# EAGLE design SparkFun_Ublox SAM-M8Q (EAGLE 9.2.1)
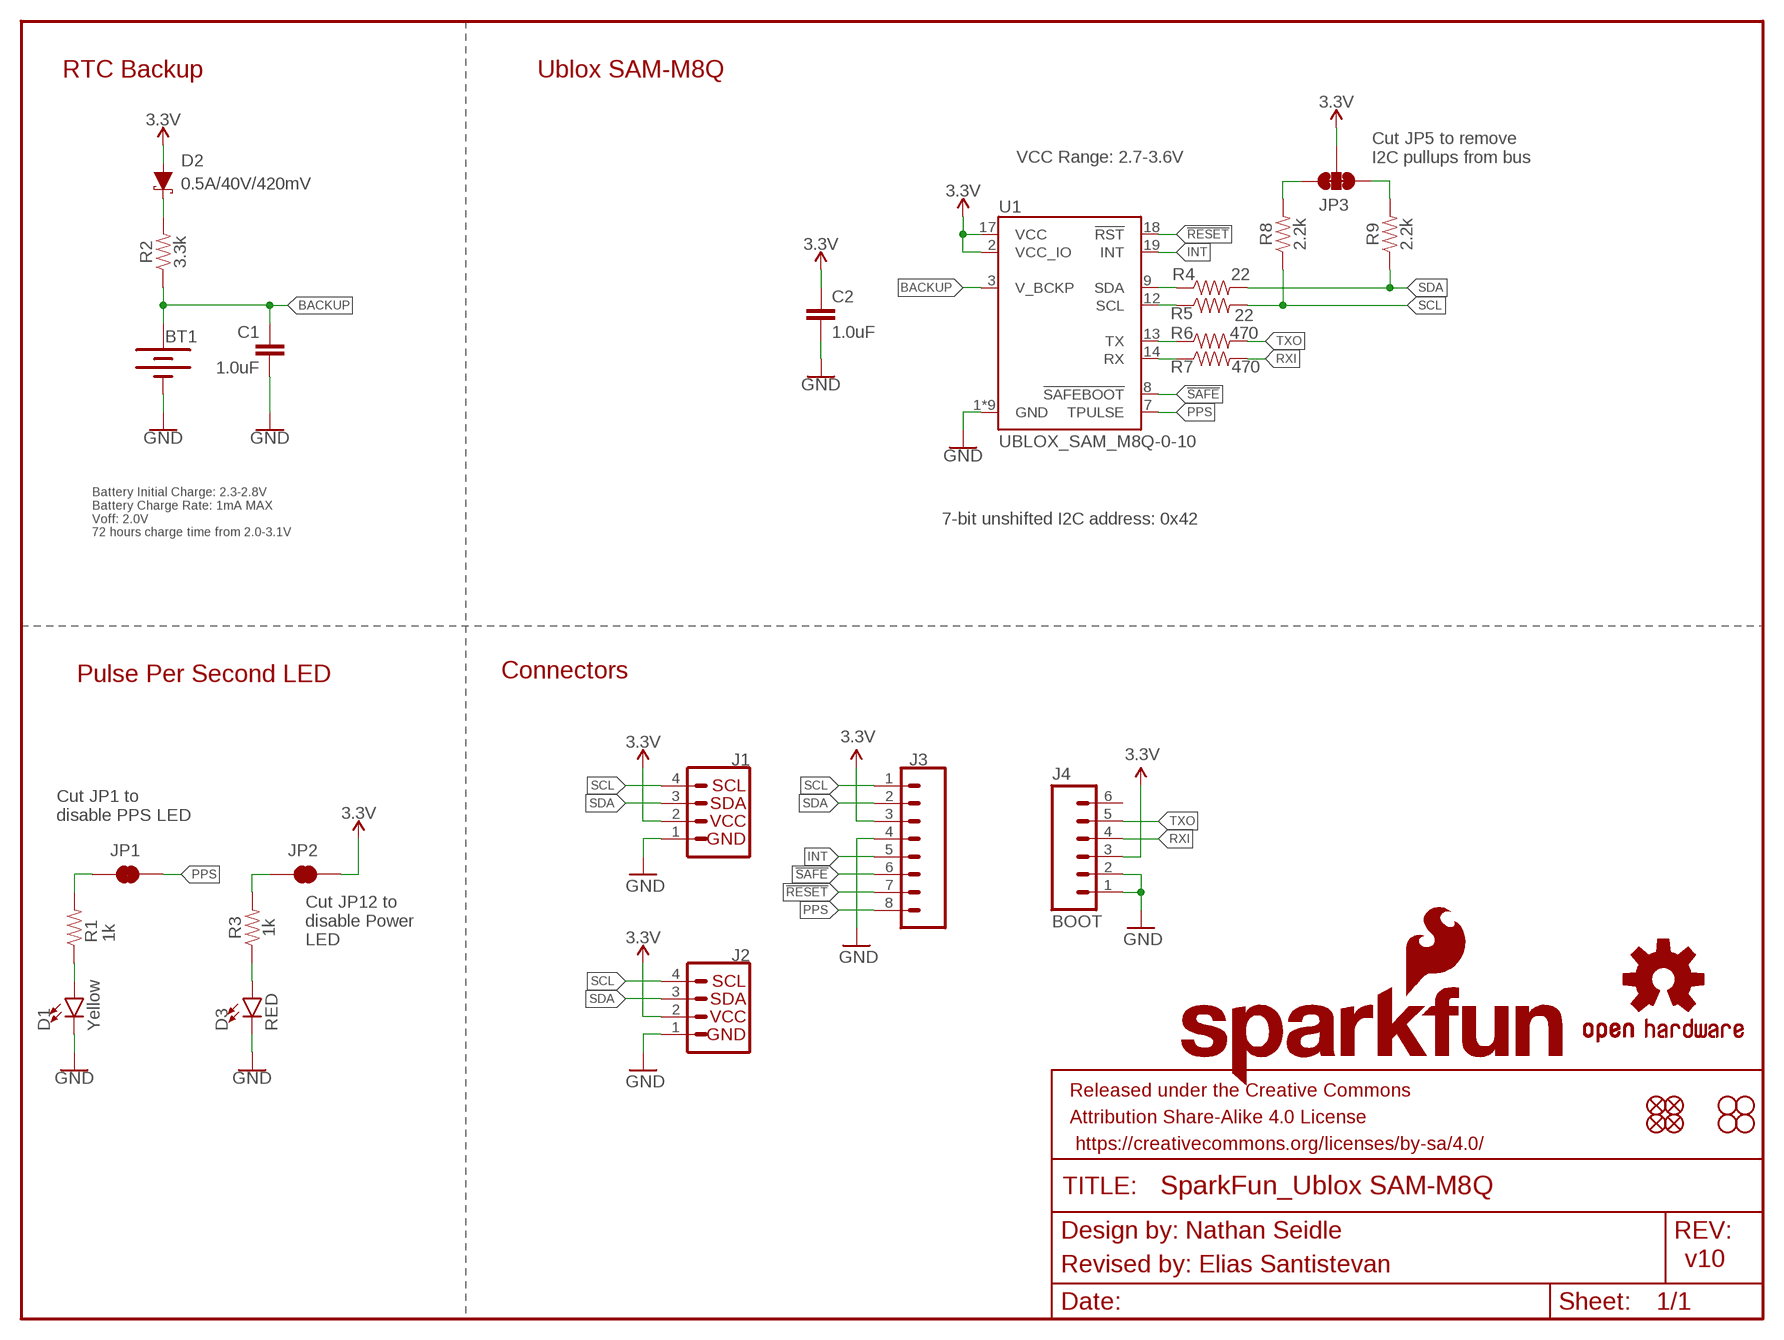
[diagram p0: schematic, sheet 1]

## Parts
BT1  6.8MM_COIN_CELL  ML414H_IV01E_BATTERY  [ML414H_IV01E]
C1  1.0uF  1.0UF-0603-16V-10%  [0603]
C2  1.0uF  1.0UF-0603-16V-10%  [0603]
D1  Yellow  LED-YELLOW0603  [LED-0603]
D2  0.5A/40V/420mV  DIODE-SCHOTTKY-PMEG4005EJ  [SOD-323]
D3  RED  LED-RED0603  [LED-0603]
FD1  FIDUCIALUFIDUCIAL  [FIDUCIAL-MICRO]
FD2  FIDUCIALUFIDUCIAL  [FIDUCIAL-MICRO]
FD3  FIDUCIALUFIDUCIAL  [FIDUCIAL-MICRO]
FD4  FIDUCIALUFIDUCIAL  [FIDUCIAL-MICRO]
FRAME1  FRAME-LETTER  [CREATIVE_COMMONS]
H1  STAND-OFF  [STAND-OFF]
H2  STAND-OFF  [STAND-OFF]
H3  STAND-OFF  [STAND-OFF]
H4  STAND-OFF  [STAND-OFF]
J1  Qwiic Right Angle  I2C_STANDARDQWIIC  [JST04_1MM_RA]
J2  Qwiic Right Angle  I2C_STANDARDQWIIC  [JST04_1MM_RA]
J3  CONN_08NO_SILK_FEMALE_PTH  [1X08_NO_SILK]
J4  BOOT  CONN_06NO_SILK_NO_POP  [1X06_NO_SILK]
JP1  JUMPER-SMT_2_NC_TRACE_SILK  [SMT-JUMPER_2_NC_TRACE_SILK]
JP2  JUMPER-SMT_2_NC_TRACE_SILK  [SMT-JUMPER_2_NC_TRACE_SILK]
JP3  JUMPER-SMT_3_2-NC_TRACE_SILK  [SMT-JUMPER_3_2-NC_TRACE_SILK]
LOGO1  SFE_LOGO_NAME_FLAME.2_INCH  [SFE_LOGO_NAME_FLAME_.2]
LOGO2  OSHW-LOGOM  [OSHW-LOGO-M]
R1  1k  1KOHM-0603-1/10W-1%  [0603]
R2  3.3k  3.3KOHM-0603-1/10W-1%  [0603]
R3  1k  1KOHM-0603-1/10W-1%  [0603]
R4  22  22OHM-0603-1/10W-1%  [0603]
R5  22  22OHM-0603-1/10W-1%  [0603]
R6  470  470OHM-0603-1/10W-1%  [0603]
R7  470  470OHM-0603-1/10W-1%  [0603]
R8  2.2k  2.2KOHM-0603-1/10W-1%  [0603]
R9  2.2k  2.2KOHM-0603-1/10W-1%  [0603]
U1  UBLOX_SAM_M8Q-0-10  [SAM-M8Q]

## Nets
3.3V: C2.1 D2.A J1.2 J2.2 J3.3 J4.3 JP2.2 JP3.2 U1.2(VCC_IO) U1.17(VCC)
!RESET: J3.7 U1.18(!RST)
!SAFE: J3.6 U1.8(!SAFEBOOT)
BACKUP: BT1.+ C1.1 R2.1 U1.3(V_BCKP)
GND: BT1.- C1.2 C2.2 D1.C D3.C J1.1 J2.1 J3.4 J4.1 J4.2 U1.1(GND) U1.4(GND) U1.5(GND) U1.6(GND) U1.10(GND) U1.11(GND) U1.15(GND) U1.16(GND) U1.20(GND)
INT: J3.5 U1.19(INT)
N$1: JP2.1 R3.2
N$2: D1.A R1.1
N$3: D3.A R3.1
N$4: JP1.1 R1.2
N$5: JP3.1 R9.2
N$6: D2.C R2.2
N$8: JP3.3 R8.2
PPS: J3.8 JP1.2 U1.7(TPULSE)
RXI: J4.4 R7.2
RXLV: R7.1 U1.14(RX)
SCL: J1.4 J2.4 J3.1 R5.2 R8.1
SCL_LV: R5.1 U1.12(SCL)
SDA: J1.3 J2.3 J3.2 R4.2 R9.1
SDA_LV: R4.1 U1.9(SDA)
TXLV: R6.1 U1.13(TX)
TXO: J4.5 R6.2
Unconnected: J4.6

## Notes on the sheet
- RTC Backup | Ublox SAM-M8Q
- VCC Range: 2.7-3.6V
- Cut JP5 to remove 
  I2C pullups from bus
- 7-bit unshifted I2C address: 0x42
- Battery Initial Charge: 2.3-2.8V
  Battery Charge Rate: 1mA MAX
  Voff: 2.0V
  72 hours charge time from 2.0-3.1V
- Pulse Per Second LED | Connectors
- Cut JP1 to 
  disable PPS LED
- Cut JP12 to 
  disable Power 
  LED
- Nathan Seidle
- Revised by: Elias Santistevan | v10

## Library data of the parts
BT1 = SparkFun-Batteries:ML414H_IV01E_BATTERY: SEIKO ML414H-IV01E Reflowable Lithium Battery ML414H is a rechargeable, coin type battery with features such as Pb-free reflowable (Peak temperature: 260 C) and high temperature heat resistance. Battery Characteristics: 3.1V max voltage Voff is 2V 1mAH 3k series resistor with battery 72 hour charge time from 2.0-3.1V 2.3-2.8V initial charge; PROD_ID: BATT-14267
C1 C2 = SparkFun-Capacitors:1.0UF: 1µF ceramic capacitors A capacitor is a passive two-terminal electrical component used to store electrical energy temporarily in an electric field.; PROD_ID: CAP-00868
D1 = SparkFun-LED:LED-YELLOW: Yellow SMD LED Used in manufacturing several products at SparkFun. Packages: 0603 - SMD 0603 package[Product Link] <http://www.kingbrightusa.com/product.asp?catalog_name=LED&product_id=APT1608SYCK> 0603 -SMART - SMART SMD 0603 package (more efficient/more expensive) [Product Link] <http://www.osram-os.com/osram_os/en/products/product-catalog/led-light-emitting-diodes/smartled-0603/ly-l29k/index.jsp> LilyPad - SMD1206 package[Product Datasheet] <https://www.sparkfun.com/datasheets/DevTools/LilyPad/Q150YUS4.pdf> SparkFun Products: Blynk Board <https://www.sparkfun.com/products/13794> IOIO-OTG <https://www.sparkfun.com/products/13613> XBee Explorer Serial <https://www.sparkfun.com/products/13225>; PROD_ID: DIO-09003
D2 = SparkFun-DiscreteSemi:DIODE-SCHOTTKY: Schottky diode A Schottky diode is a semiconductor diode which has a low forward voltage drop and a very fast switching action.; PROD_ID: DIO-10955
D3 = SparkFun-LED:LED-RED: Red SMD LED Used in manufacturing of most products at SparkFun Packages: 0603 - SMD 0603 package [Product Link] <http://docs.avagotech.com/docs/AV02-0551EN> 0603 SMART - SMD 0603 SMART package ( more efficient and expensive)[Product Link] <http://www.osram-os.com/Graphics/XPic2/00077099_0.pdf> 1206 - SMD1206 package [Product Link] <https://www.sparkfun.com/datasheets/DevTools/LilyPad/Q150OVS4.pdff> SparkFun Products: Pro Mini 328 -5V <https://www.sparkfun.com/products/821> RedBoard <https://www.sparkfun.com/products/12757> IOIO-OTG <https://www.sparkfun.com/products/13613>; PROD_ID: DIO-00819
FD1-FD4 = SparkFun-Aesthetics:FIDUCIAL: Fiducial Alignment Points Point-of-reference for pick-and-place machines and other optical instruments.
FRAME1 = SparkFun-Aesthetics:FRAME-LETTER: Schematic Frame - Letter Standard 8.5x11 US Letter frame
H1-H4 = SparkFun-Hardware:STAND-OFF: Stand Off Drill holes for mechanically mounting via screws, standoffs, etc. Note: Use the keepout ring to avoid running the screw head into surrounding components. Variant Overviews STAND-OFF - Mechanical footprint for a #4 phillips button head screw. STAND-OFF-TIGHT - Mechanical footprint for a #4 phillips button head screw, Example SparkFun Products Screw - Phillips Head (1/4", 4-40, 10 pack) <https://www.sparkfun.com/products/10453> (PRT-10453) Screw - Phillips Head (1/2", 4-40, 10 pack) <https://www.sparkfun.com/products/10452> (PRT-10452) Screw - Phillips Head (3/4", 4-40, 10 pack) <https://www.sparkfun.com/products/10451> (PRT-10451) Screw - Phillips Head (1", 4-40, 10 pack) <https://www.sparkfun.com/products/10450> (PRT-10450)
J1 J2 = SparkFun-Connectors:I2C_STANDARD: SparkFun I2C Standard Pinout Header SparkFun has standardized on a pinout for all I2C based sensor breakouts. This pinout allows I2C boards to be plugged directly into the headers on Arduino Uno compatible boards, and to be daisy chained easily. Example SparkFun Products: SparkFun Atmospheric Sensor Breakout - BME280 <https://www.sparkfun.com/products/13676> SparkFun Altitude/Pressure Sensor Breakout - MPL3115A2 <https://www.sparkfun.com/products/11084> SparkFun TOF Range Finder Sensor - VL6180 <https://www.sparkfun.com/products/12785>; PROD_ID: CONN-13694
J3 = SparkFun-Connectors:CONN_08: Multi connection point. Often used as Generic Header-pin footprint for 0.1 inch spaced/style header connections On any of the 0.1 inch spaced packages, you can populate with these: Break Away Headers - Straight <https://www.sparkfun.com/products/116> (PRT-00116) Break Away Male Headers - Right Angle <https://www.sparkfun.com/products/553> (PRT-00553) Female Headers <https://www.sparkfun.com/products/115> (PRT-00115) Break Away Headers - Machine Pin <https://www.sparkfun.com/products/117> (PRT-00117) Break Away Female Headers - Swiss Machine Pin <https://www.sparkfun.com/products/743> (PRT-00743) Arduino Stackable Header - 8 Pin <https://www.sparkfun.com/products/9279> (PRT-09279) For SCREWTERMINALS and SPRING TERMINALS visit here: Screw Terimnals on SparkFun.com <https://www.sparkfun.com/search/results?term=Screw+Terminals> (5mm/3.5mm/2.54mm spacing) This device is also useful as a general connection point to wire up your design to another part of your project. Our various solder wires solder well into these plated through hole pads. Hook-Up Wire - Assortment (Stranded, 22 AWG) <https://www.sparkfun.com/products/11375> (PRT-11375) Hook-Up Wire - Assortment (Solid Core, 22 AWG) <https://www.sparkfun.com/products/11367> (PRT-11367) View the entire wire category on our website here <https://www.sparkfun.com/categories/141> Special notes: Molex polarized connector foot print use with SKU : PRT-08231 with associated crimp pins and housings. 1MM SMD Version SKU: PRT-10208 NOTES ON THE VARIANTS LOCK and LOCK_LONGPADS... This footprint was designed to help hold the alignment of a through-hole component (i.e. 6-pin header) while soldering it into place. You may notice that each hole has been shifted either up or down by 0.005 of an inch from it's more standard position (which is a perfectly straight line). This slight alteration caused the pins (the squares in the middle) to touch the edges of the holes. Because they are alternating, it causes a "brace" to hold the component in place. 0.005 has proven to be the perfect amount of "off-center" position when using our standard breakaway headers. Although looks a little odd when you look at the bare footprint, once you have a header in there, the alteration is very hard to notice. Also,if you push a header all the way into place, it is covered up entirely on the bottom side.; PROD_ID: CONN-08438
J4 = SparkFun-Connectors:CONN_06: Multi connection point. Often used as Generic Header-pin footprint for 0.1 inch spaced/style header connections On any of the 0.1 inch spaced packages, you can populate with these: Break Away Headers - Straight <https://www.sparkfun.com/products/116> (PRT-00116) Break Away Male Headers - Right Angle <https://www.sparkfun.com/products/553> (PRT-00553) Female Headers <https://www.sparkfun.com/products/115> (PRT-00115) Break Away Headers - Machine Pin <https://www.sparkfun.com/products/117> (PRT-00117) Break Away Female Headers - Swiss Machine Pin <https://www.sparkfun.com/products/743> (PRT-00743) Arduino Stackable Header - 6 Pin <https://www.sparkfun.com/products/9280> (PRT-09280) For SCREWTERMINALS and SPRING TERMINALS visit here: Screw Terimnals on SparkFun.com <https://www.sparkfun.com/search/results?term=Screw+Terminals> (5mm/3.5mm/2.54mm spacing) This device is also useful as a general connection point to wire up your design to another part of your project. Our various solder wires solder well into these plated through hole pads. Hook-Up Wire - Assortment (Stranded, 22 AWG) <https://www.sparkfun.com/products/11375> (PRT-11375) Hook-Up Wire - Assortment (Solid Core, 22 AWG) <https://www.sparkfun.com/products/11367> (PRT-11367) View the entire wire category on our website here <https://www.sparkfun.com/categories/141>
JP1 JP2 = SparkFun-Jumpers:JUMPER-SMT_2_NC_TRACE: Normally closed trace jumper This jumper has a trace between two pads so it's normally closed (NC). Use a razor knife to open the connection. For best results follow the IPC guidelines for cutting traces: Cutout at least 0.063 mm (0.005 in). Remove all loose material to clean up the cut area. Seal the cut with an approved epoxy. Reapply solder to reclose the connection.
JP3 = SparkFun-Jumpers:JUMPER-SMT_3_2-NC_TRACE: Normally closed trace jumper (2 of 2 connections) This jumper has a trace between all three pads so they are normally closed (NC). Use a razor knife to open the connection(s). For best results follow the IPC guidelines for cutting traces: Cutout at least 0.063 mm (0.005 in). Remove all loose material to clean up the cut area. Seal the cut with an approved epoxy. Reapply solder to reclose the connection(s).
LOGO1 = SparkFun-Aesthetics:SFE_LOGO_NAME_FLAME: SparkFun Font Logo w/ Flame This is the SparkFun full logo. The logo on the schematic will always be the same size; the package variant is the height of the flame part of the logo. Default layer for the logo on the board is tSilk.
LOGO2 = SparkFun-Aesthetics:OSHW-LOGO: Open-Source Hardware (OSHW) Logo This logo indicates the piece of hardware it is found on incorporates a OSHW license and/or adheres to the definition of open source hardware found here: http://freedomdefined.org/OSHW
R1 R3 = SparkFun-Resistors:1KOHM: 1kΩ resistor A resistor is a passive two-terminal electrical component that implements electrical resistance as a circuit element. Resistors act to reduce current flow, and, at the same time, act to lower voltage levels within circuits. - Wikipedia; PROD_ID: RES-07856
R2 = SparkFun-Resistors:3.3KOHM: 3.3kΩ resistor A resistor is a passive two-terminal electrical component that implements electrical resistance as a circuit element. Resistors act to reduce current flow, and, at the same time, act to lower voltage levels within circuits. - Wikipedia; PROD_ID: RES-07851
R4 R5 = SparkFun-Resistors:22OHM: 22Ω resistor A resistor is a passive two-terminal electrical component that implements electrical resistance as a circuit element. Resistors act to reduce current flow, and, at the same time, act to lower voltage levels within circuits. - Wikipedia; PROD_ID: RES-08698
R6 R7 = SparkFun-Resistors:470OHM: 470Ω resistor A resistor is a passive two-terminal electrical component that implements electrical resistance as a circuit element. Resistors act to reduce current flow, and, at the same time, act to lower voltage levels within circuits. - Wikipedia; PROD_ID: RES-07869
R8 R9 = SparkFun-Resistors:2.2KOHM: 2.2kΩ resistor A resistor is a passive two-terminal electrical component that implements electrical resistance as a circuit element. Resistors act to reduce current flow, and, at the same time, act to lower voltage levels within circuits. - Wikipedia; PROD_ID: RES-08272
U1 = SparkFun-GPS:UBLOX_SAM_M8Q-0-10: u-blox SAM-M8Q The u-blox concurrent SAM-M8Q GNSS patch antenna module benefits from the exceptional performance of the u-blox M8 multi-GNSS engine. The SAM-M8Q module offers high sensitivity and minimal acquisition times in an ultra compact form factor. The SAM-M8Q module utilizes concurrent reception of up to three GNSS systems (GPS/Galileo and GLONASS), recognizes multiple constellations simultaneously and provides outstanding positioning accuracy in scenarios where urban canyon or weak signals are involved. For even better and faster positioning improvement, the SAM-M8Q supports augmentation of QZSS, GAGAN and IMES together with WAAS, EGNOS, MSAS. The SAM-M8Q also supports message integrity protection, geofencing, and spoofing detection with configurable interface settings to easily fit to customer applications.; PROD_ID: IC-14070

## Net classes
0 default: width 0.254 mm
1 vcc: width 0.305 mm

## Board
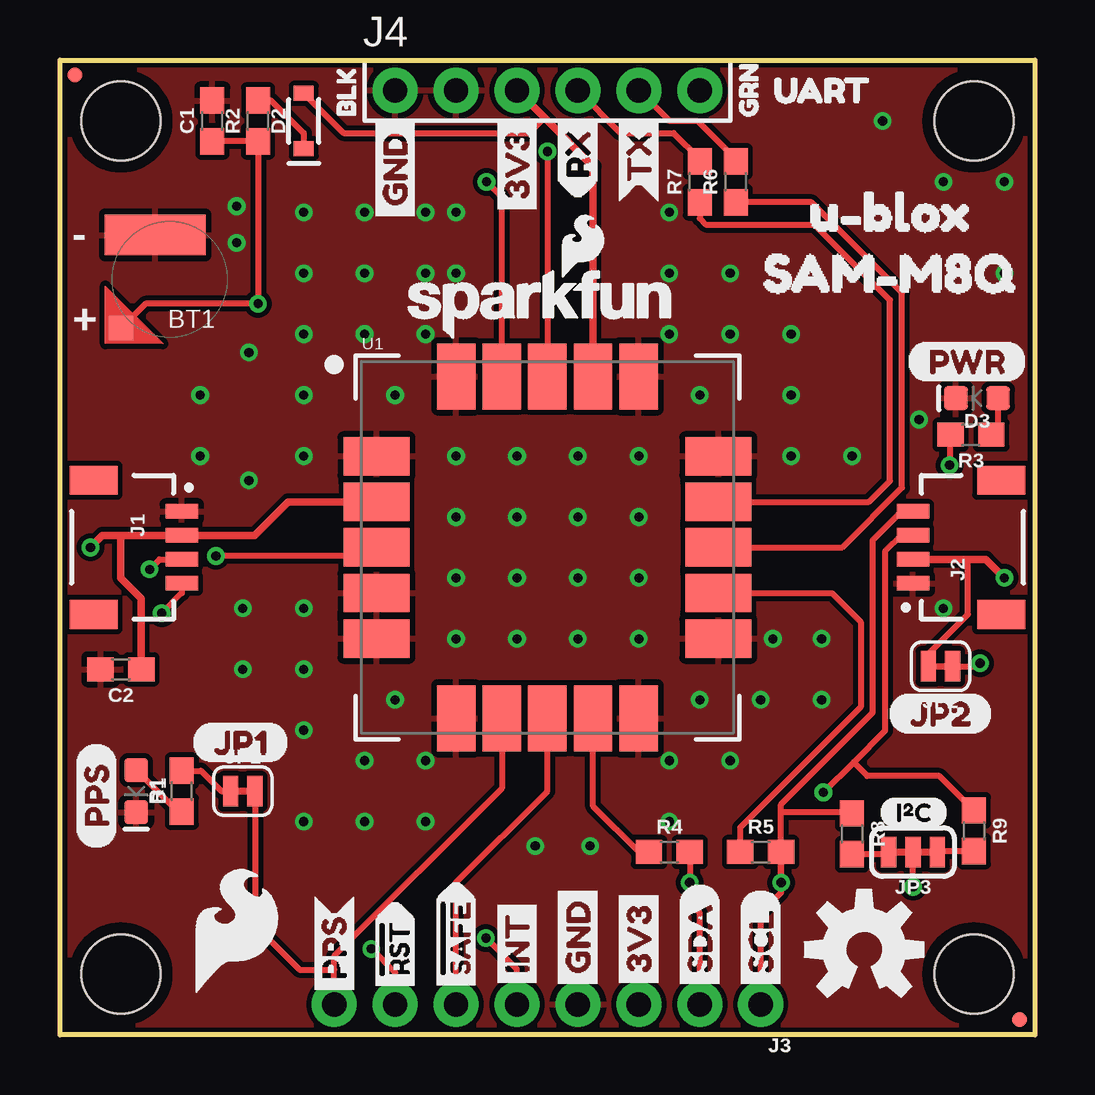
[diagram p1: board, top side]
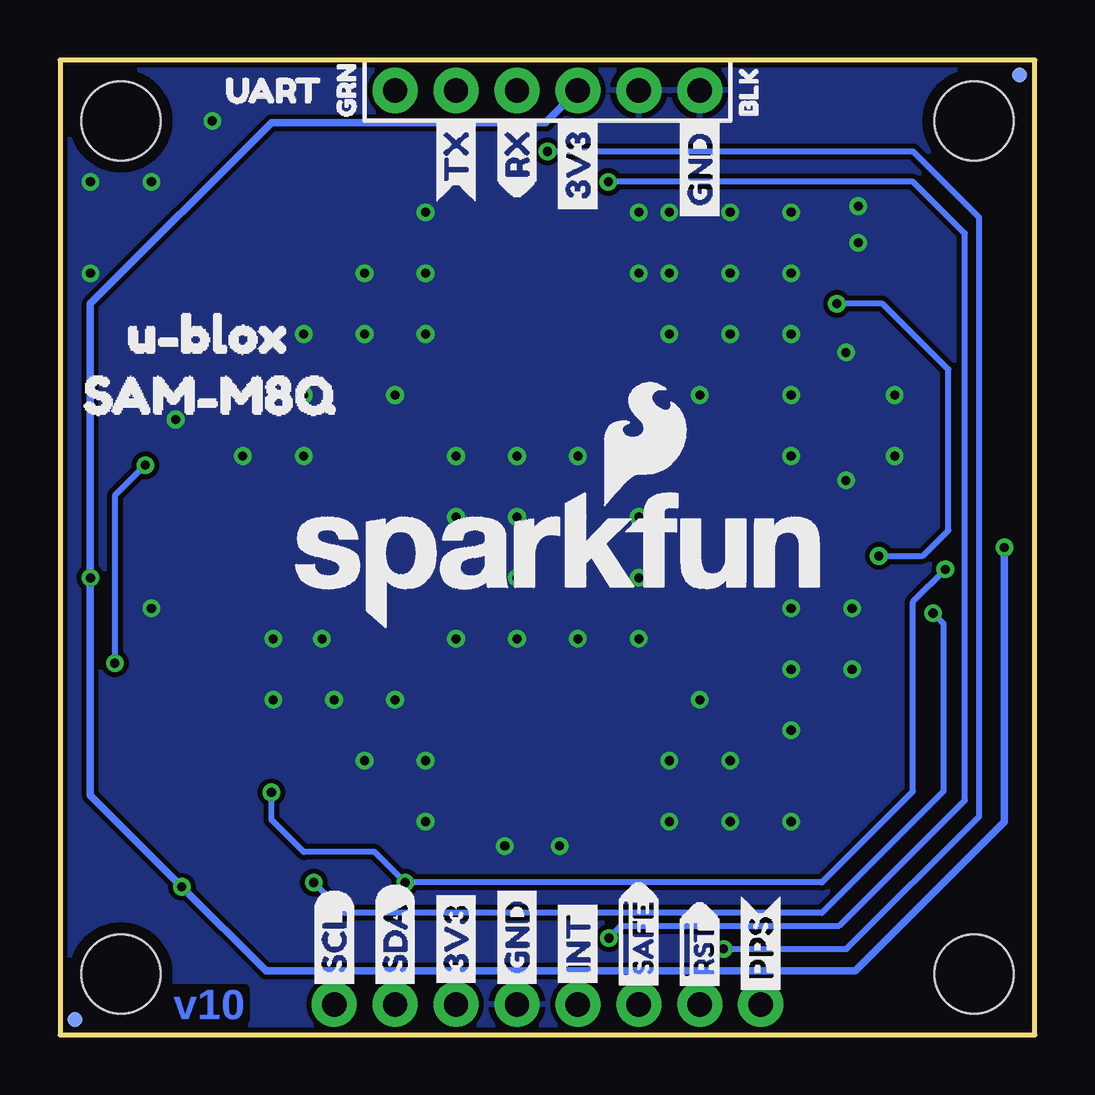
[diagram p2: board, bottom side, seen from below]

Size 40.64 x 40.64 mm. Coordinates in mm from the lower left corner, seen from the top.
Outline: 0,0 0,40.64 40.64,40.64 40.64,0 0,0
Copper layers (1*16): Top 0.035mm / dielectric 1.5mm / Bottom 0.035mm
Design rules "SparkFun-2-layer-TIGHT": minimum track width 7mil, minimum drill 15mil, track to track 7mil, track to pad 7mil, pad to pad 7mil, via to via 7mil, smd to smd 7mil, copper to edge 7mil, drill to drill 7mil, minimum pad ring 7mil, minimum via ring 7mil, stop-mask expansion 4mil, vias tented up to drill 25mil, thermal gap 10mil

### Footprints (pad centres in the part's own frame; a part is rotated, then mirrored left to right if it is on the bottom)
ML414H_IV01E = smd 1 x 1: + 2.022,2.032 | smd 4.2 x 1.7: - 0.6,-1.85
0603 = smd 1.1 x 1: 1 -0.85,0; 2 0.85,0
LED-0603 = smd 1 x 1: A -0.877,0; C 0.877,0
SOD-323 = smd 0.63 x 0.83: A 1.15,0; C -1.15,0
FIDUCIAL-MICRO = smd 0.635 x 0.635: 1 0,0
STAND-OFF = hole 3.302: 0,0
JST04_1MM_RA = smd 0.6 x 1.35: 1 -1.5,0; 2 -0.5,0; 3 0.5,0; 4 1.5,0 | smd 1.2 x 2: NC1 2.8,-3.675; NC2 -2.8,-3.675
1X08_NO_SILK = drill 1.016 pad 1.88: 1 0,0; 2 2.54,0; 3 5.08,0; 4 7.62,0; 5 10.16,0; 6 12.7,0; 7 15.24,0; 8 17.78,0
1X06_NO_SILK = drill 1.016 pad 1.88: 1 0,0; 2 2.54,0; 3 5.08,0; 4 7.62,0; 5 10.16,0; 6 12.7,0
SMT-JUMPER_2_NC_TRACE_SILK = smd 0.635 x 1.27: 1 -0.508,0; 2 0.508,0
SMT-JUMPER_3_2-NC_TRACE_SILK = smd 0.635 x 1.27: 1 -1.016,0; 2 0,0; 3 1.016,0
SAM-M8Q = smd 2.75 x 1.6: 1 -7.125,3.8; 2 -7.125,1.9; 3 -7.125,0; 4 -7.125,-1.9; 5 -7.125,-3.8; 11 7.125,-3.8; 12 7.125,-1.9; 13 7.125,0; 14 7.125,1.9; 15 7.125,3.8 | smd 1.6 x 2.75: 6 -3.8,-7.125; 7 -1.9,-7.125; 8 0,-7.125; 9 1.9,-7.125; 10 3.8,-7.125; 16 3.8,7.125; 17 1.9,7.125; 18 0,7.125; 19 -1.9,7.125; 20 -3.8,7.125

### Placement (x,y rotation side)
BT1  4.57,31.5 180 top
C1  6.35,38.1 90 top
C2  2.54,15.24 180 top
D1  3.17,10.16 270 top
D2  10.16,38.1 90 top
D3  38.23,26.54 180 top
FD1  40.01,0.64 0 top
FD2  40.01,0.64 0 bottom
FD3  0.64,40.01 0 top
FD4  0.64,40.01 0 bottom
FRAME1  -17.78,-17.78 0 top  (outside the outline)
H1  2.54,2.54 0 top
H2  38.1,2.54 0 top
H3  2.54,38.1 0 top
H4  38.1,38.1 0 top
J1  5.08,20.32 270 top
J2  35.56,20.32 90 top
J3  29.21,1.27 180 top
J4  13.97,39.37 0 top
JP1  7.62,10.16 0 top
JP2  36.7,15.37 180 top
JP3  35.56,7.62 180 top
LOGO1  19.81,19.81 0 bottom
LOGO2  33.53,3.56 0 top
R1  5.08,10.16 90 top
R2  8.26,38.1 90 top
R3  37.97,25.02 180 top
R4  25.4,7.62 0 top
R5  29.21,7.62 0 top
R6  28.17,35.56 90 top
R7  26.67,35.56 90 top
R8  33.02,8.38 270 top
R9  38.1,8.51 270 top
U1  20.32,20.32 0 top
U$1  [SDA-[)]  26.67,1.65 90 top
U$2  [SFE_LOGO_FLAME_.2]  7.37,4.32 0 top
U$3  [SCL-[)]  29.21,1.65 90 top
U$4  [SDA-[)]  26.67,1.65 90 bottom
U$5  [SCL-[)]  29.21,1.65 90 bottom
U$6  [3V3-04]  24.13,1.65 90 top
U$7  [3V3-04]  24.13,1.65 90 bottom
U$8  [GND-04]  21.59,1.65 90 top
U$9  [GND-04]  21.59,1.65 90 bottom
U$10  [I_SUPER2_C-()-03]  34.16,9.27 0 top
U$11  [UART0]  34.67,39.37 0 bottom
U$12  [BLK1]  11.94,37.59 90 top
U$13  [BLK1]  11.94,37.59 90 bottom
U$14  [GRN2]  28.7,37.59 90 top
U$15  [INT8]  19.05,1.65 90 top
U$16  [INT8]  19.05,1.65 90 bottom
U$17  [GRN2]  28.7,37.59 90 bottom
U$18  [JP10]  5.46,12.19 0 top
U$19  [RX6]  21.59,34.8 90 top
U$20  [RX6]  21.59,34.8 90 bottom
U$21  [SAM#M8Q4]  27.94,31.75 0 top
U$22  [U#BLOX3]  39.24,29.21 0 bottom
U$23  [TX7]  24.13,34.67 90 top
U$24  [TX7]  24.13,34.67 90 bottom
U$25  [SAM#M8Q4]  41.02,26.67 0 bottom
U$26  [U#BLOX3]  29.84,34.29 0 top
U$27  [3V3-04]  19.05,33.91 90 top
U$28  [SFE_LOGO_NAME_FLAME_.1]  20.07,30.48 0 top
U$29  [PPS0]  1.52,7.75 90 top
U$30  [PWR0]  35.31,28.07 0 top
U$31  [JP20]  34.52,13.39 0 top
U$32  [3V3-04]  19.05,33.91 90 bottom
U$33  [GND-04]  13.97,33.66 90 top
U$34  [GND-04]  13.97,33.66 90 bottom
U$35  [#RST3]  13.97,1.4 90 top
U$36  [#RST3]  13.97,1.4 90 bottom
U$39  [#SAFE1]  16.51,1.4 90 top
U$40  [#SAFE1]  16.51,1.4 90 bottom
U$43  [PPS5]  11.43,1.4 90 top
U$44  [PPS5]  11.43,1.4 90 bottom
U$45  [UART0]  28.83,39.37 0 top

### Tracks (layer width: path | path; a pad name or v marks a point on that pad's centre or on a via)
3.3V  (via drill 0.38)
  Top 0.254: D2.A 11.82,37.59 19.56,37.59 20.19,38.23 | JP2.2 36.2,15.88 37.85,17.53 37.85,19.82 | v35.56,6.17 JP3.2
  Top 0.305: U1.2 9.52,22.22 8.12,20.82 J1.2 2.54,20.82 | v39.37,19.05 38.6,19.82 37.85,19.82 J2.2 | U1.17 22.22,36.2 20.19,38.23 J4.3 | v1.27,20.32 1.77,20.82 2.54,20.82 | C2.1 3.39,18.2 2.54,19.05 2.54,20.82
  Bottom 0.305: J4.3 20.4,38.02 31.83,38.02 39.37,30.48 v39.37,19.05 39.37,9.98 v35.56,6.17 32.05,2.67 24.13,2.67 | 24.13,2.67 7.49,2.67 1.27,8.89 v1.27,20.32 | J3.3 24.13,2.67
!RESET  (via drill 0.38)
  Top 0.254: v20.32,36.83 U1.18 | v12.98,3.58 13.97,2.59 J3.7
  Bottom 0.254: v12.98,3.58 7.85,3.58 2.34,9.09 2.34,34.09 5.08,36.83 v20.32,36.83
!SAFE
  Top 0.254: U1.8 20.32,10.16 16.51,6.35 J3.6
BACKUP  (via drill 0.38)
  Top 0.254: C1.1 R2.1 v8.26,30.48 3.57,30.48 BT1.+ | U1.3 12.84,19.96 v6.5,19.96
  Bottom 0.254: v6.5,19.96 4.67,19.96 3.61,21.03 3.61,27.74 6.35,30.48 v8.26,30.48
GND  (via drill 0.38)
  other vias: 16.51,24.13 19.05,24.13 21.59,24.13 24.13,24.13 16.51,19.05 19.05,19.05 21.59,19.05 24.13,19.05 16.51,21.59 19.05,21.59 21.59,21.59 24.13,21.59 10.16,17.78 10.16,15.24 10.16,12.7 12.7,11.43 13.97,13.97 26.67,13.97 26.67,26.67 13.97,26.67 10.16,24.13 10.16,26.67 10.16,29.21 12.7,29.21 27.94,29.21 30.48,29.21 30.48,26.67 30.48,24.13 27.94,11.43 25.4,11.43 15.24,11.43 15.24,29.21 25.4,29.21 34.29,38.1 36.83,35.56 39.37,35.56 39.37,31.75 16.51,16.51 19.05,16.51 21.59,16.51 24.13,16.51 16.51,31.75 12.7,31.75 10.16,31.75 25.4,31.75 27.94,31.75 25.4,34.29 29.21,13.97 31.75,13.97 31.75,16.51 29.72,16.51 36.83,17.78 33.02,24.13 16.51,34.29 12.7,34.29 10.16,34.29 15.24,31.75 15.24,34.29 15.24,8.89 12.7,8.89 10.16,8.89 7.62,17.78 7.62,15.24 25.4,8.89 5.84,26.67 5.84,24.13 7.87,28.45 7.37,34.54 7.37,33.02 22.1,7.87 19.81,7.87 7.87,23.11 35.81,25.65
  pour Top (isolate 0.203): 0,40.64 40.64,40.64 40.64,0 0,0
  pour Bottom (isolate 0.203): 0,40.64 40.64,40.64 40.64,0 0,0
INT  (via drill 0.38)
  Top 0.254: v17.78,35.56 18.42,34.92 U1.19 | v17.75,4.04 19.05,2.74 J3.5
  Bottom 0.254: v17.75,4.04 17.25,4.55 8.15,4.55 2.92,9.78 2.92,33.4 5.08,35.56 v17.78,35.56
N$1  (via drill 0.38)
  Top 0.254: R3.2 37.08,24.98 v37.08,23.75 | JP2.1 38.23,15.37 v38.35,15.49
  Bottom 0.254: v37.08,23.75 38.35,22.48 v38.35,15.49
N$2
  Top 0.254: R1.1 4.9,9.31 D1.A
N$3
  Top 0.254: D3.A 39.1,25.3 R3.1
N$4
  Top 0.254: JP1.1 6.73,10.16 5.88,11.01 R1.2
N$5
  Top 0.254: R9.2 36.62,7.66 JP3.1
N$6
  Top 0.254: R2.2 8.8,38.95 10.16,37.59 D2.C
N$8
  Top 0.254: JP3.3 34.46,7.53 R8.2
PPS
  Top 0.254: JP1.2 8.13,4.57 9.98,2.72 11.43,2.72 | U1.7 18.42,10.28 11.43,3.29 11.43,2.72 | J3.8 11.43,2.72
RXI
  Top 0.254: J4.4 23.37,37.59 25.58,37.59 26.67,36.5 R7.2
RXLV
  Top 0.254: U1.14 33.73,22.22 34.59,23.09 34.59,30.63 31.45,33.78 26.92,33.78 26.67,34.04 R7.1
SCL  (via drill 0.38)
  Top 0.254: R5.2 30.06,5.93 29.21,5.08 J3.1 | v30.06,6.35 R5.2 | J1.4 5.08,18.41 v4.24,17.58 | J2.4 35.08,21.82 33.88,20.62 33.88,13.44 30.06,9.61 30.06,9.27 | R5.2 30.06,9.27 | R8.1 32.98,9.27 30.06,9.27
  Bottom 0.254: v4.24,17.58 3.81,17.14 3.81,10.16 8.89,5.08 28.79,5.08 v30.06,6.35
SCL_LV
  Top 0.254: R5.1 28.36,8.65 33.38,13.66 33.38,17.22 32.18,18.42 U1.12
SDA  (via drill 0.38)
  Top 0.254: R4.2 v26.25,6.35 26.25,5.5 26.67,5.08 J3.2 | v3.73,19.41 4.15,19.82 J1.3 | R9.1 36.66,10.79 33.66,10.79 33.08,11.37 | v31.83,10.11 33.08,11.37 | 33.08,11.37 34.39,12.68 34.39,20.17 35.04,20.82 J2.3
  Bottom 0.254: v3.73,19.41 5.08,18.06 5.08,10.16 8.89,6.35 v26.25,6.35 27.52,7.62 30.48,7.62 31.83,8.97 v31.83,10.11
SDA_LV
  Top 0.254: U1.9 22.22,9.53 24.13,7.62 R4.1
TXLV
  Top 0.254: U1.13 32.61,20.32 35.1,22.81 35.1,30.94 31.33,34.71 R6.1
TXO
  Top 0.254: J4.5 25.4,38.1 26.16,38.1 26.57,38.1 28.17,36.5 R6.2

### Text on the board
Bottom: v10
tPlace: - | +
Measures: Measurements in inches
tDocu: Nathan Seidle | Revised By: Elias Santistevan